# EAGLE design CallForHelp (EAGLE 9.6.2)
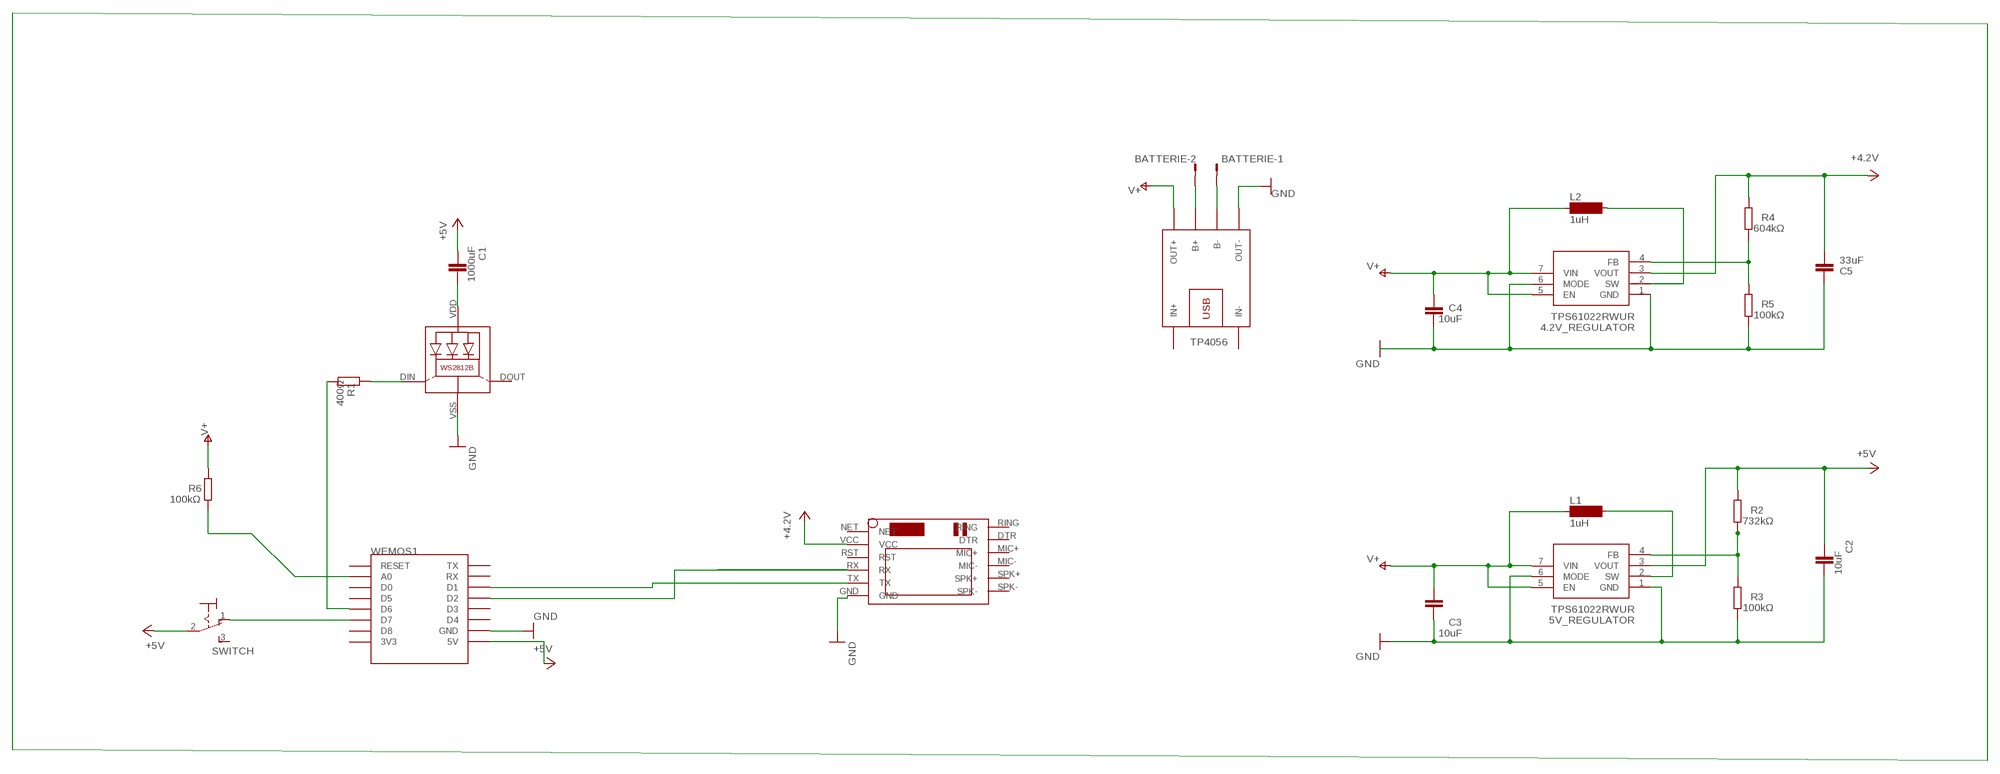
[diagram p0: schematic, sheet 1]

## Parts
4.2V_REGULATOR  TPS61022RWUR  [TPS61022RWUR]
5V_REGULATOR  TPS61022RWUR  [TPS61022RWUR]
BATTERIE  L02P  [L02P]
C1  1000uF  C2,5-3  [C2.5-3]
C2  10uF  C2,5-3  [C2.5-3]
C3  10uF  C2,5-3  [C2.5-3]
C4  10uF  C2,5-3  [C2.5-3]
C5  33uF  C2,5-3  [C2.5-3]
L1  1uH  SM-L15A  [SM-L15A]
L2  1uH  SM-L15A  [SM-L15A]
LED1  WS2812B  [WS2812B]
R1  400Ω  R-EU_0204/7  [0204/7]
R2  732kΩ  R-EU_0204/7  [0204/7]
R3  100kΩ  R-EU_0204/7  [0204/7]
R4  604kΩ  R-EU_0204/7  [0204/7]
R5  100kΩ  R-EU_0204/7  [0204/7]
R6  100kΩ  R-EU_0204/7  [0204/7]
SIM800L  SIM800LMODULE  [SIM800LMODULE]
SWITCH  320-916  [320-916]
TP4056  BATTERY-CHARGER-LI-PROT  [BATTERY-CHARGER-LI-PROT]
WEMOS1  WEMOS-D1-MINI  [WEMOS-D1-MINI]

## Nets
+5V: 5V_REGULATOR.3(VOUT) C1.1 C2.1 R2.2 SWITCH.2(P) WEMOS1.5V
BATTERY_GND: BATTERIE.1 TP4056.B-
BATTERY_VCC: BATTERIE.2 TP4056.B+
GND: 4.2V_REGULATOR.1(GND) 4.2V_REGULATOR.6(MODE) 5V_REGULATOR.1(GND) 5V_REGULATOR.6(MODE) C2.2 C3.2 C4.2 C5.1 LED1.VSS(GND) R3.1 R5.1 SIM800L.GND TP4056.OUT- WEMOS1.GND
LED_PIN: R1.1 WEMOS1.D6
N$2: 5V_REGULATOR.4(FB) R2.1 R3.2
N$3: LED1.DIN(DI) R1.2
N$4: 4.2V_REGULATOR.4(FB) R4.1 R5.2
N$5: R6.1 WEMOS1.A0
N$6: SIM800L.RX WEMOS1.D2
N$7: SIM800L.TX WEMOS1.D1
N$8: SWITCH.1(O) WEMOS1.D7
N$9: 4.2V_REGULATOR.2(SW) L2.2
N$10: 5V_REGULATOR.2(SW) L1.2
N$11: C1.2 LED1.VDD
V+: 4.2V_REGULATOR.5(EN) 4.2V_REGULATOR.7(VIN) 5V_REGULATOR.5(EN) 5V_REGULATOR.7(VIN) C3.1 C4.1 L1.1 L2.1 R6.2 TP4056.OUT+
VCC: 4.2V_REGULATOR.3(VOUT) C5.2 R4.2 SIM800L.VCC ; supply symbol labelled +4.2V
Unconnected: LED1.DOUT(DO) SIM800L.DTR SIM800L.MIC+ SIM800L.MIC- SIM800L.NET SIM800L.RING SIM800L.RST SIM800L.SPK+ SIM800L.SPK- SWITCH.3(S) TP4056.IN+ TP4056.IN- WEMOS1.3V3 WEMOS1.D0 WEMOS1.D3 WEMOS1.D4 WEMOS1.D5 WEMOS1.D8 WEMOS1.RESET WEMOS1.RX WEMOS1.TX

## Library data of the parts
4.2V_REGULATOR 5V_REGULATOR = TPS61022RWUR:TPS61022RWUR: 8-A boost converter with 0.5-V ultra-low input voltage Source: Datasheet <http://www.ti.com/lit/gpn/TPS61022>; ARROW_PART_NUMBER: TPS61022RWUR; ARROW_PRICE-STOCK: https://www.arrow.com/en/products/tps61022rwur/texas-instruments; DESCRIPTION: 8-A boost converter with 0.5-V ultra-low input voltage; HEIGHT: 1mm; MANUFACTURER_NAME: Texas Instruments; MANUFACTURER_PART_NUMBER: TPS61022RWUR; MOUSER_PART_NUMBER: 595-TPS61022RWUR; MOUSER_PRICE-STOCK: https://www.mouser.co.uk/ProductDetail/Texas-Instruments/TPS61022RWUR?qs=vLWxofP3U2zlxrk4cD0iFA%3D%3D
BATTERIE = con-amp-mt:L02P: AMP MT CONNECTOR; OC_FARNELL: unknown; OC_NEWARK: unknown
C1-C5 = capacitor-wima:C: CAPACITOR naming: grid - package width
L1 L2 = inductor-neosid:SM-L15: INDUCTOR SMD air coil with pick and place cap; OC_FARNELL: unknown; OC_NEWARK: unknown
LED1 = Ws2812B:WS2812B: Features and Benefits  * Intelligent reverse connect protection, the power supply reverse connection does not damage the IC. * The control circuit and the LED share the only power source. Control circuit and RGB chip are integrated in a package of 5050 components, form a complete control of pixel point.  * Built-in signal reshaping circuit, after wave reshaping to the next driver, ensure wave-form distortion not accumulate.  * Built-in electric reset circuit and power lost reset circuit.  * Each pixel of the three primary color can achieve 256 brightness display, completed 16777216 color full color display, and scan frequency not less than 400Hz/s.  * Cascading port transmission signal by single line.  * Any two point the distance more than 5m transmission signal without any increase circuit.  * When the refresh rate is 30fps, cascade number are not less than1024 points.  * Send data at speeds of 800Kbps.  *The color of the light were highly consistent, cost-effective. Applications  Full-color module, Full color soft lights a lamp strip. LED decorative lighting, Indoor/outdoor LED video irregular screen. General description WS2812B is a intelligent control LED light source that the control circuit and RGB chip are integrated in a package of 5050 components. It internal include intelligent digital port data latch and signal reshaping amplification drive circuit. Also include a precision internal oscillator and a 12V voltage programmable constant curre-nt control part, effectively ensuring the pixel point light color height consistent. The data transfer protocol use single NZR communication mode. After the pixel power-on reset, the DIN port receive data from controller, the first pixel collect initial 24bit data then sent to the internal data latch, the other data which reshaping by the internal signal reshaping amplification circuit sent to the next cascade pixel through the DO port. After transmission for each pixel,the signal to reduce 24bit. pixel adopt auto reshaping transmit technology, making the pixel cascade number is not limited the signal transmission, only depend on the speed of signal transmission. LED with low driving voltage, environmental protection and energy saving, high brightness, scattering angle is large, good consistency, low power, long life and other advantages. The control chip integrated in LED above becoming more simple circuit, small volume, convenient installation. Absolute Maximum Ratings Power supply voltage: VDD +3.5V..+5.3V Input voltage: VI -0.5V..VDD+0.5V based on WS2812 from https://github.com/adafruit/Adafruit-Eagle-Library
R1-R6 = rcl:R-EU_: RESISTOR, European symbol; SPICEPREFIX: R
SIM800L = SIM800LMODULE:SIM800LMODULE: SIM800L Module
SWITCH = switch:320-916: TOGGLE SWITCH distributor RS Components
TP4056 = TP4056 - Lipo Charger:BATTERY-CHARGER-LI-PROT: Lithium Battery 5V Charger with protection circuit More details available here: http://www.instructables.com/id/DIY-Lithium-ion-Battery-Charger/step4/TP4056-based-lithium-ion-battery-charger-module/ Click here to find device on ebay.com <http://www.ebay.com/sch/tp4056+charger+usb+protection>
WEMOS1 = esp8266modules:WEMOS-D1-MINI: WeMos.cc D1 mini ESP8266 module

## Board
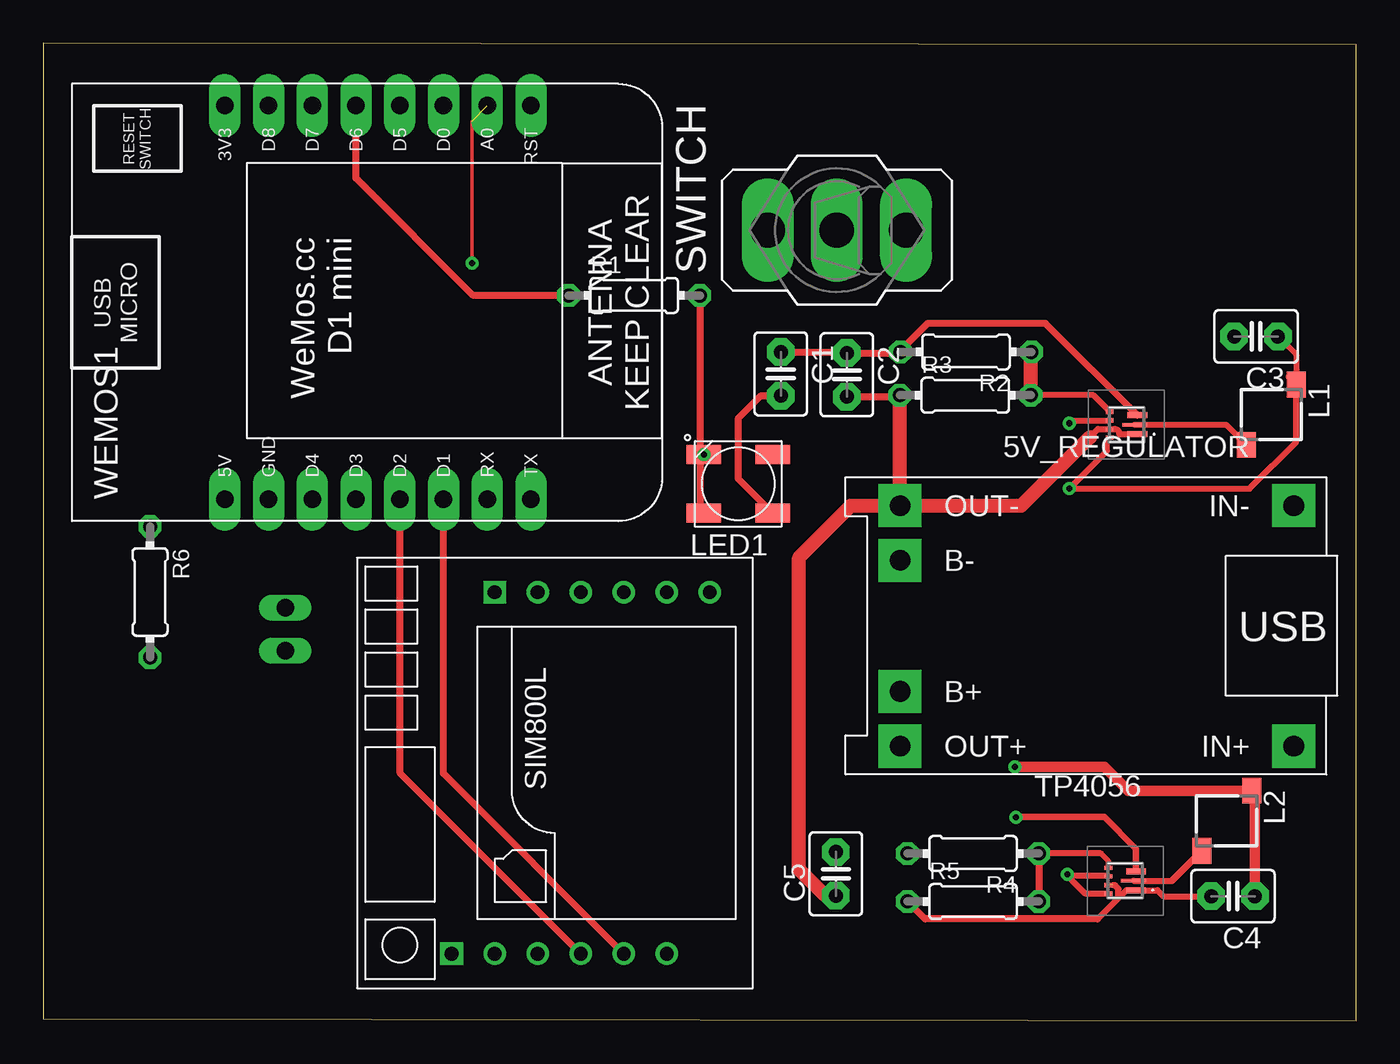
[diagram p1: board, top side]
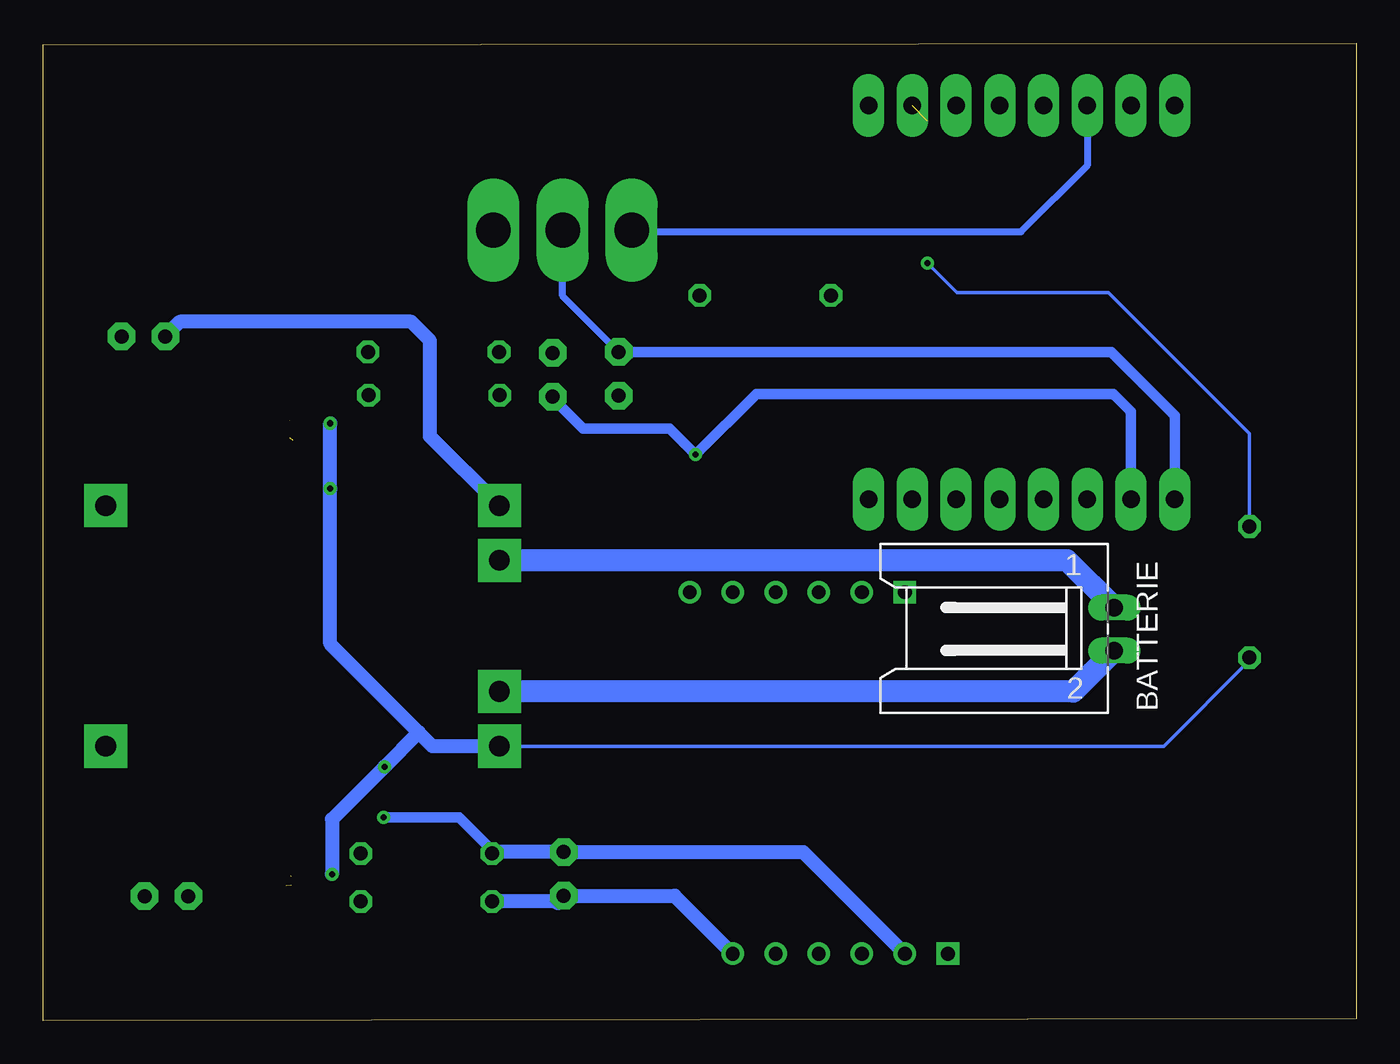
[diagram p2: board, bottom side, seen from below]

Size 76.29 x 56.79 mm. Coordinates in mm from the lower left corner, seen from the top.
Outline: 0,0.1 76.29,0 76.29,56.69 0,56.79 0,0.1
Copper layers (1*16): Top 0.035mm / dielectric 1.5mm / Bottom 0.035mm
Design rules "default": minimum track width 6mil, minimum drill 0.35mm, track to track 6mil, track to pad 6mil, pad to pad 6mil, via to via 6mil, smd to smd 6mil, copper to edge 40mil, drill to drill 6mil, minimum pad ring 10mil, minimum via ring 8mil, stop-mask expansion 4mil, vias tented up to drill 0mil, thermal gap 10mil

### Footprints (pad centres in the part's own frame; a part is rotated, then mirrored left to right if it is on the bottom)
TPS61022RWUR = smd 1.15 x 0.35: 1 -0.625,0.55; 3 -0.625,-0.55 | smd 1.45 x 0.2: 2 -0.475,0 | smd 0.45 x 0.25: 4 0.975,-0.75; 5 0.975,-0.25; 6 0.975,0.25; 7 0.975,0.75
L02P = drill 1.016 long: 1 1.25,-6.25; 2 -1.25,-6.25
C2.5-3 = drill 0.813 pad 1.6 octagon: 1 -1.27,0; 2 1.27,0
SM-L15A = smd 1.1 x 1.5: 1 -1.45,-1.75; 2 1.45,1.75
WS2812B = smd 2 x 1.1: DIN 2,1.7; DOUT -2,-1.7; VDD -2,1.7; VSS 2,-1.7
0204/7 = drill 0.813 octagon: 1 -3.81,0; 2 3.81,0
SIM800LMODULE = drill 0.8: DTR 10.5,1; GND -10.5,-6.5; MIC+ 10.5,-1.5; MIC- 10.5,-4; RST -10.5,1; RX -10.5,-1.5; SPK+ 10.5,-6.5; SPK- 10.5,-9; TX -10.5,-4; VCC -10.5,3.5 | drill 0.8 square: NET -10.5,6; RING 10.5,3.5
320-916 = drill 2.007 long: 1 0,4.013; 2 0,0; 3 0,-4.013
BATTERY-CHARGER-LI-PROT = drill 1.2 pad 2.5 square: B+ 10.795,3.81; B- 10.795,-3.81; IN+ -12.065,6.985; IN- -12.065,-6.985; OUT+ 10.795,6.985; OUT- 10.795,-6.985
WEMOS-D1-MINI = drill 1.016 pad 1.829 long: 3V3 -10.16,-10.16; 5V 12.7,-10.16; A0 -10.16,5.08; D0 -10.16,2.54; D1 12.7,2.54; D2 12.7,0; D3 12.7,-2.54; D4 12.7,-5.08; D5 -10.16,0; D6 -10.16,-2.54; D7 -10.16,-5.08; D8 -10.16,-7.62; GND 12.7,-7.62; RESET -10.16,7.62; RX 12.7,5.08; TX 12.7,7.62

### Placement (x,y rotation side)
4.2V_REGULATOR  62.86,8.13 180 top
5V_REGULATOR  62.93,34.62 180 top
BATTERIE  20.32,22.75 90 bottom
C1  42.85,37.57 270 top
C2  46.69,37.52 270 top
C3  70.46,39.75 180 top
C4  69.12,7.23 180 top
C5  46.05,8.53 90 top
L1  71.34,35.2 180 top
L2  68.75,11.61 180 top
LED1  40.38,31.18 180 top
R1  34.34,42.13 0 top
R2  53.61,38.85 180 top
R3  53.57,36.33 0 top
R4  54.02,9.71 180 top
R5  54.02,6.92 0 top
R6  6.21,24.9 270 top
SIM800L  29.73,14.39 90 top
SWITCH  46.11,45.92 90 top
TP4056  60.58,22.93 180 top
WEMOS1  20.72,42.99 270 top

### Tracks (layer width: path | path; a pad name or v marks a point on that pad's centre or on a via)
+5V
  Top 0.406: 5V_REGULATOR.3 58.23,40.5 51.37,40.5 49.76,38.89 49.66,38.79 C2.1 46.64,38.84 C1.1
  Top 0.813: 49.76,38.89 R2.2
  Bottom 0.406: C1.1 46.11,42.1 SWITCH.2
  Bottom 0.61: WEMOS1.5V 10.56,35.15 14.25,38.84 C1.1
BATTERY_GND
  Bottom 1.27: BATTERIE.1 16.81,26.74 TP4056.B-
BATTERY_VCC
  Bottom 1.27: BATTERIE.2 16.45,19.12 TP4056.B+
GND  (via drill 0.35)  (1 unrouted)
  Top 0.35: 62.47,7.11 62.47,7.65 62.26,7.86 62.16,7.86 | 61.26,5.9 62.47,7.11 | 62.47,7.11 62.94,7.58 4.2V_REGULATOR.1 64.73,7.58 65.08,7.23 C4.2 | 5V_REGULATOR.1 62.54,34.07 arc-90 62.51,34.1 arc90 62.24,34.37 5V_REGULATOR.6 61.28,34.37 60.81,33.9
  Top 0.406: R5.1 51.23,5.9 61.26,5.9 | C2.2 49.73,36.25 49.79,36.3
  Top 0.813: C5.1 45.45,7.26 43.91,8.8 43.91,26.9 46.93,29.91 TP4056.OUT- | TP4056.OUT- 56.83,29.91 60.81,33.9 | TP4056.OUT- 49.79,36.3 R3.1
  Bottom 0.61: WEMOS1.GND 13.1,35.39 14.11,36.4 34.86,36.4 LED1.VSS 39.9,34.4 44.91,34.4 46.69,36.18 C2.2
  Bottom 0.813: 46.39,6.92 R5.1 | C5.1 39.6,7.26 SIM800L.GND | TP4056.OUT- 53.81,33.94 53.81,39.5 54.91,40.6 68.34,40.6 C3.2
  Bottom 1.016: C5.1 46.39,6.92
  other vias: 38.38,32.88
LED_PIN
  Top 0.406: R1.1 24.98,42.13 18.18,48.93 WEMOS1.D6
N$2
  Top 0.35: 57.62,36.57 R3.2 61,36.33 5V_REGULATOR.4
  Top 0.813: R3.2 57.38,38.81 R2.1
N$3
  Top 0.406: R1.2 38.15,29.71 LED1.DIN
N$4
  Top 0.305: 4.2V_REGULATOR.4 61.89,9.28 61.46,9.71
  Top 0.35: 61.46,9.71 R4.1
  Top 0.4: R4.1 R5.2
N$5  (via drill 0.35)  (1 unrouted)
  Top 0.203: v24.91,44 24.91,52.26
  Bottom 0.203: R6.1 6.21,34.1 14.41,42.3 23.21,42.3 v24.91,44
N$6
  Top 0.406: WEMOS1.D2 20.72,14.4 SIM800L.RX
N$7
  Top 0.406: SIM800L.TX 23.26,14.36 WEMOS1.D1
N$8
  Bottom 0.406: WEMOS1.D7 15.64,49.67 19.49,45.82 42,45.82 SWITCH.1
N$9
  Top 0.35: 4.2V_REGULATOR.2 65.57,8.13
  Top 0.406: 65.57,8.13 L2.2
N$10
  Top 0.35: 5V_REGULATOR.2 68.72,34.62 L1.2
N$11
  Top 0.406: LED1.VDD 40.38,31.48 40.38,34.97 41.71,36.3 C1.2
V+  (via drill 0.35)  (3 unrouted)
  Top 0.35: 61.87,8.4 59.61,8.4 v59.51,8.5 59.51,8.4 60.53,7.38 4.2V_REGULATOR.7 | 72.34,37.4 L1.1 | v59.61,34.7 59.78,34.87 5V_REGULATOR.5 | 61.81,33.72 61.81,33.1 v59.61,30.9 70.07,30.9 72.79,33.62 L1.1 | C3.1 72.79,38.69 L1.1
  Top 0.61: C4.1 70.39,13.17 L2.1 63.05,13.36 61.66,14.75 v56.46,14.75
  Bottom 0.203: R6.2 6.21,20.92 11.19,15.95 TP4056.OUT+
  Bottom 0.813: v59.51,8.5 59.51,11.7 v56.46,14.75 54.47,16.74 | 49.85,16.01 TP4056.OUT+ 53.66,15.95 54.47,16.74 | v59.61,34.7 v59.61,30.9 59.61,21.89 54.47,16.74
VCC  (via drill 0.35)
  Top 0.38: 4.2V_REGULATOR.3 63.48,9.98 61.64,11.83 56.54,11.83 v56.51,11.8
  Bottom 0.61: R4.2 50.21,9.9 52.11,11.8 v56.51,11.8
  Bottom 0.813: 50.12,9.8 C5.2 32.14,9.8 SIM800L.VCC
  Bottom 1.016: 50.12,9.8 R4.2